# Altium project Low Distortion Oscillator.PrjPcb
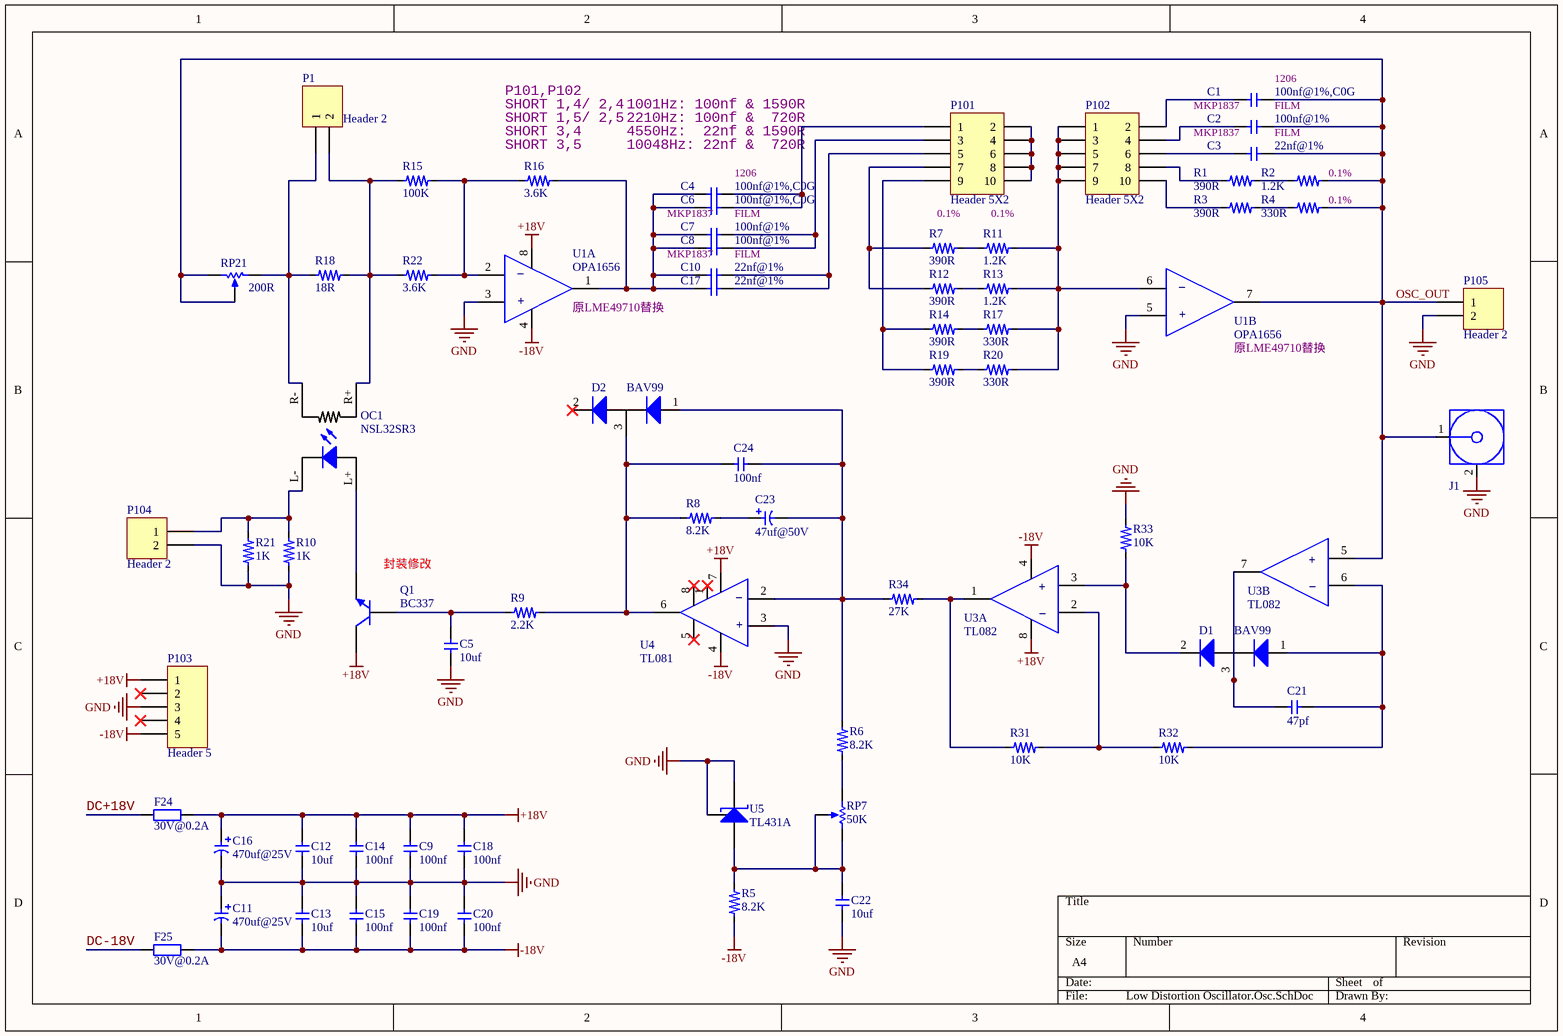
[diagram p0: Low Distortion Oscillator.Osc.SchDoc]
8 sheets, 279 parts. Net scope: global (net labels, ports and power ports of the same name join across sheets).
Board file: Low Distortion Oscillator.PcbDoc
Sheets:
  Low Distortion Oscillator.Osc.SchDoc
  Low Distortion Oscillator.Con.SchDoc
  Low Distortion Oscillator.Notch1.SchDoc
  Low Distortion Oscillator.Amp.SchDoc
  Low Distortion Oscillator.Amp2.SchDoc
  Low Distortion Oscillator.Amp3.SchDoc
  Low Distortion Oscillator.DCDC.SchDoc
  Low Distortion Oscillator.LDO.SchDoc

## Sheet Low Distortion Oscillator.Osc.SchDoc
size A4

### Parts
(Parts that share a designator on the sheet are numbered #1, #2 ... from top to bottom, then left to right.)
C1  value 100nf@1%,C0G  [C1206]  (hidden comment: Cap)
C2  value 100nf@1%  [CAP-FILM-7.2X8.5X10-P5X0.5]  (hidden comment: Cap-Film)
C3  value 22nf@1%  [CAP-FILM-7.2X5.5X7.0-P5X0.5]  (hidden comment: Cap-Film)
C4  value 100nf@1%,C0G  [C1206]  (hidden comment: Cap)
C5  value 10uf  [C0805]  (hidden comment: Cap)
C6  value 100nf@1%,C0G  [C1206]  (hidden comment: Cap)
C7  value 100nf@1%  [CAP-FILM-7.2X8.5X10-P5X0.5]  (hidden comment: Cap-Film)
C8  value 100nf@1%  [CAP-FILM-7.2X8.5X10-P5X0.5]  (hidden comment: Cap-Film)
C9  value 100nf  [C0805]  (hidden comment: Cap)
C10  value 22nf@1%  [CAP-FILM-7.2X5.5X7.0-P5X0.5]  (hidden comment: Cap-Film)
C11  value 470uf@25V  [C8X12]  (hidden comment: Cap2)
C12  value 10uf  [C1206]  (hidden comment: Cap)
C13  value 10uf  [C1206]  (hidden comment: Cap)
C14  value 100nf  [C0805]  (hidden comment: Cap)
C15  value 100nf  [C0805]  (hidden comment: Cap)
C16  value 470uf@25V  [C8X12]  (hidden comment: Cap2)
C17  value 22nf@1%  [CAP-FILM-7.2X5.5X7.0-P5X0.5]  (hidden comment: Cap-Film)
C18  value 100nf  [C0805]  (hidden comment: Cap)
C19  value 100nf  [C0805]  (hidden comment: Cap)
C20  value 100nf  [C0805]  (hidden comment: Cap)
C21  value 47pf  [C0805]  (hidden comment: Cap)
C22  value 10uf  [C0805]  (hidden comment: Cap)
C23  value 47uf@50V  [C6.3X11]  (hidden comment: Cap2)
C24  value 100nf  [C0805]  (hidden comment: Cap)
D1  BAV99  [BAV99-SOT23]
D2  BAV99  [BAV99-SOT23]
F24  value 30V@0.2A  [F1210]  (hidden comment: Fuse)
F25  value 30V@0.2A  [F1210]  (hidden comment: Fuse)
J1  SMA  [SMA-2]  (value not drawn)
OC1  NSL32SR3  [NSL32SR3]
P1  Header 2  [HDR1X2]
P101#1  Header 5X2  [HDR2X5]
P102  Header 5X2  [HDR2X5]
P103  Header 5  [HDR1X5]
P104  Header 2  [HDR1X2]
P105  Header 2  [HDR1X2]
Q1  BC337  [NPN-TO92-CBE]
R1  value 390R  [R0805]  (hidden comment: Res)
R2  value 1.2K  [R0805]  (hidden comment: Res)
R3  value 390R  [R0805]  (hidden comment: Res)
R4  value 330R  [R0805]  (hidden comment: Res)
R5  value 8.2K  [R0805]  (hidden comment: Res)
R6  value 8.2K  [R0805]  (hidden comment: Res)
R7  value 390R  [R0805]  (hidden comment: Res)
R8  value 8.2K  [R0805]  (hidden comment: Res)
R9  value 2.2K  [R0805]  (hidden comment: Res)
R10  value 1K  [R1206]  (hidden comment: Res)
R11  value 1.2K  [R0805]  (hidden comment: Res)
R12  value 390R  [R0805]  (hidden comment: Res)
R13  value 1.2K  [R0805]  (hidden comment: Res)
R14  value 390R  [R0805]  (hidden comment: Res)
R15  value 100K  [R0805]  (hidden comment: Res)
R16  value 3.6K  [R0805]  (hidden comment: Res)
R17  value 330R  [R0805]  (hidden comment: Res)
R18  value 18R  [R0805]  (hidden comment: Res)
R19  value 390R  [R0805]  (hidden comment: Res)
R20  value 330R  [R0805]  (hidden comment: Res)
R21  value 1K  [R1206]  (hidden comment: Res)
R22  value 3.6K  [R0805]  (hidden comment: Res)
R31  value 10K  [R0805]  (hidden comment: Res)
R32  value 10K  [R0805]  (hidden comment: Res)
R33  value 10K  [R0805]  (hidden comment: Res)
R34  value 27K  [R0805]  (hidden comment: Res)
RP7  value 50K  [RP-3296W]  (hidden comment: Res Pot)
RP21  value 200R  [RP-3296W]  (hidden comment: Res Pot)
U1  OPA1656  [OPA1612-SOIC8]  (parts A,B of 2)
U3  TL082  [OPAMP-SOIC8]  (parts A,B of 2)
U4  TL081  [OPAMP-SOIC8]
U5  TL431A  [TL431-SOIC-8]

### Nets
+18V: C9.2 C12.2 C14.2 C16.1 C18.2 F24.2 P103.1 Q1.C U1.8(+Vs) U3.8(+Vs) U4.7(+Vs)
-18V: C11.2 C13.1 C15.1 C19.1 C20.1 F25.2 P103.5 R5.1 U1.4(-Vs) U3.4(-Vs) U4.4(-Vs)
GND: C5.1 C9.1 C11.1 C12.1 C13.2 C14.1 C15.2 C16.2 C18.1 C19.2 C20.2 C22.1 J1.2(GND) P103.3 P104.2 P105.2 R10.1 R21.1 R33.2 U1.3(+IN_A) U1.5(+IN_B) U4.3(+IN) U5.1(Cathode) U5.8(Ref)
DC+18V: F24.1
DC-18V: F25.1
OSC_OUT: C1.2 C2.2 C3.2 J1.1(Signal) P105.1 R2.2 R4.2 RP21.2(TAP) RP21.3(BOT) U1.7(OUT_B) U3.5(+IN_B)
NetC1_1: C1.1 P102.2
NetC2_1: C2.1 P102.4
NetC3_1: C3.1 P102.6
NetC4_1: C4.1 C6.1 C7.1 C8.1 C10.1 C17.1 R16.2 U1.1(OUT_A)
NetC4_2: C4.2 C6.2 P101#1.1
NetC5_2: C5.2 Q1.B R9.1
NetC7_2: C7.2 C8.2 P101#1.3
NetC10_2: C10.2 C17.2 P101#1.5
NetC21_1: C21.1 D1.3(K1/A2) U3.7(OUT_B)
NetC21_2: C21.2 D1.1(A1) R32.2 U3.6(-IN_B)
NetC22_2: C22.2 R5.2 RP7.2(TAP) RP7.3(BOT) U5.2(Anode)
NetC23_1: C23.1 R8.2
NetC23_2: C23.2 C24.2 D2.1(A1) R6.2 R34.1 U4.2(-IN)
NetC24_1: C24.1 D2.3(K1/A2) R8.1 R9.2 U4.6(OUTPUT)
NetD1_2: D1.2(K2) R33.1 U3.3(+IN_A)
NetOC1_L+: OC1.L+ Q1.E
NetOC1_L-: OC1.L- P104.1 R10.2 R21.2
NetOC1_R+: OC1.R+ P1.2 R15.1 R18.2 R22.1
NetOC1_R-: OC1.R- P1.1 R18.1 RP21.1(TOP)
NetP101#1_2: P101#1.2 P101#1.4 P101#1.6 P101#1.8 P101#1.10
NetP101#1_7: P101#1.7 R7.1 R12.1
NetP101#1_9: P101#1.9 R14.1 R19.1
NetP102_1: P102.1 P102.3 P102.5 P102.7 P102.9 R11.2 R13.2 R17.2 R20.2 U1.6(-IN_B)
NetP102_8: P102.8 R1.1
NetP102_10: P102.10 R3.1
NetR1_2: R1.2 R2.1
NetR3_2: R3.2 R4.1
NetR6_1: R6.1 RP7.1(TOP)
NetR7_2: R7.2 R11.1
NetR12_2: R12.2 R13.1
NetR14_2: R14.2 R17.1
NetR15_2: R15.2 R16.1 R22.2 U1.2(-IN_A)
NetR19_2: R19.2 R20.1
NetR31_1: R31.1 R34.2 U3.1(OUT_A)
NetR31_2: R31.2 R32.1 U3.2(-IN_A)

Not connected (* = marked no-connect by the designer): D2 2(K2)*; P103 2* 4*; U4 1(OFFSET_NULL)* 5(NC)* 8(OFFSET_NULL)*

### Notes on the sheet
- SHORT 1,4/ 2,4
- P101,P102
- 1001Hz: 100nf & 1590R
- MKP1837
- (near C1) 1206
- FILM
- SHORT 1,5/ 2,5
- (near R16) SHORT 3,4
- (near R16) SHORT 3,5
- 2210Hz: 100nf &  720R
- 4550Hz:  22nf & 1590R
- 10048Hz: 22nf &  720R
- 1206
- (near R2) 0.1%
- (near C6) MKP1837
- 0.1%
- (near R4) 0.1%
- (near U1) 原LME49710替换
- (near C8) MKP1837
- (near Q1) 封装修改
- (in symbol OP AMP 1#) –; +
- (in symbol OP AMP 2#, part A) +; –
- (in symbol OP AMP 2#, part B) +; –
- (in symbol OPA1612, part A) –; +
- (in symbol OPA1612, part B) –; +

### Library data of the parts
D1 D2 = BAV99: Small Signal Switching Diode, Dual in Series
OC1 = NSL32SR3: This optocoupler, NSL-32SR3, consists of an LED input optically coupled to a photocell. The photocell resistance is high when the LED current is “off” and low resistance when the LED current is “on”.
P1 P104 P105 = Header 2: Header, 2-Pin
P101#1 P102 = Header 5X2: Header, 5-Pin, Dual row
P103 = Header 5: Header, 5-Pin
Q1 = NPN: NPN General Purpose Amplifier
R1-R22 R31-R34 = Res: 电阻
RP7 RP21 = Res Pot: 电位器
U1 = OPA1612: OPA161x SoundPlus™ High-Performance, Bipolar-Input Audio Operational Amplifiers
U3 = OP AMP 2#: Universal Operational Amplifiers.
U4 = OP AMP 1#: Universal Operational Amplifiers.
U5 = TL431: 精密可编程基准

## Sheet Low Distortion Oscillator.Con.SchDoc
size A4; SheetNumber: 1; SheetTotal: 1
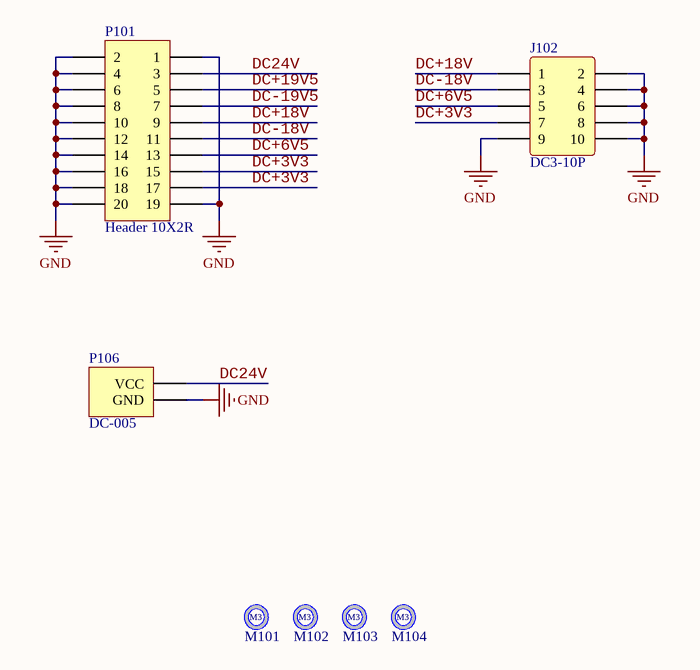
[diagram p1: Low Distortion Oscillator.Con.SchDoc]

### Parts
(Parts that share a designator on the sheet are numbered #1, #2 ... from top to bottom, then left to right.)
J102  DC3-10P  [DC3-10P]
M101  M3  [M3-3.2X5]  (value not drawn)
M102  M3  [M3-3.2X5]  (value not drawn)
M103  M3  [M3-3.2X5]  (value not drawn)
M104  M3  [M3-3.2X5]  (value not drawn)
P101#2  Header 10X2R  [HDR2X10LFR]
P106  DC-005  [DC-005]

### Nets
GND: J102.2 J102.4 J102.6 J102.8 J102.9 J102.10 P101#2.1 P101#2.2 P101#2.4 P101#2.6 P101#2.8 P101#2.10 P101#2.12 P101#2.14 P101#2.16 P101#2.18 P101#2.19 P101#2.20 P106.2(GND)
DC24V: P101#2.3 P106.1(VCC)
DC+3V3: J102.7 P101#2.15 P101#2.17
DC+6V5: J102.5 P101#2.13
DC+18V: J102.1 P101#2.9
DC+19V5: P101#2.5
DC-18V: J102.3 P101#2.11
DC-19V5: P101#2.7

### Library data of the parts
P101#2 = Header 10X2R: Header, 10-Pin, Dual row, Pin 1 on Right

## Sheet Low Distortion Oscillator.Notch1.SchDoc
size A4
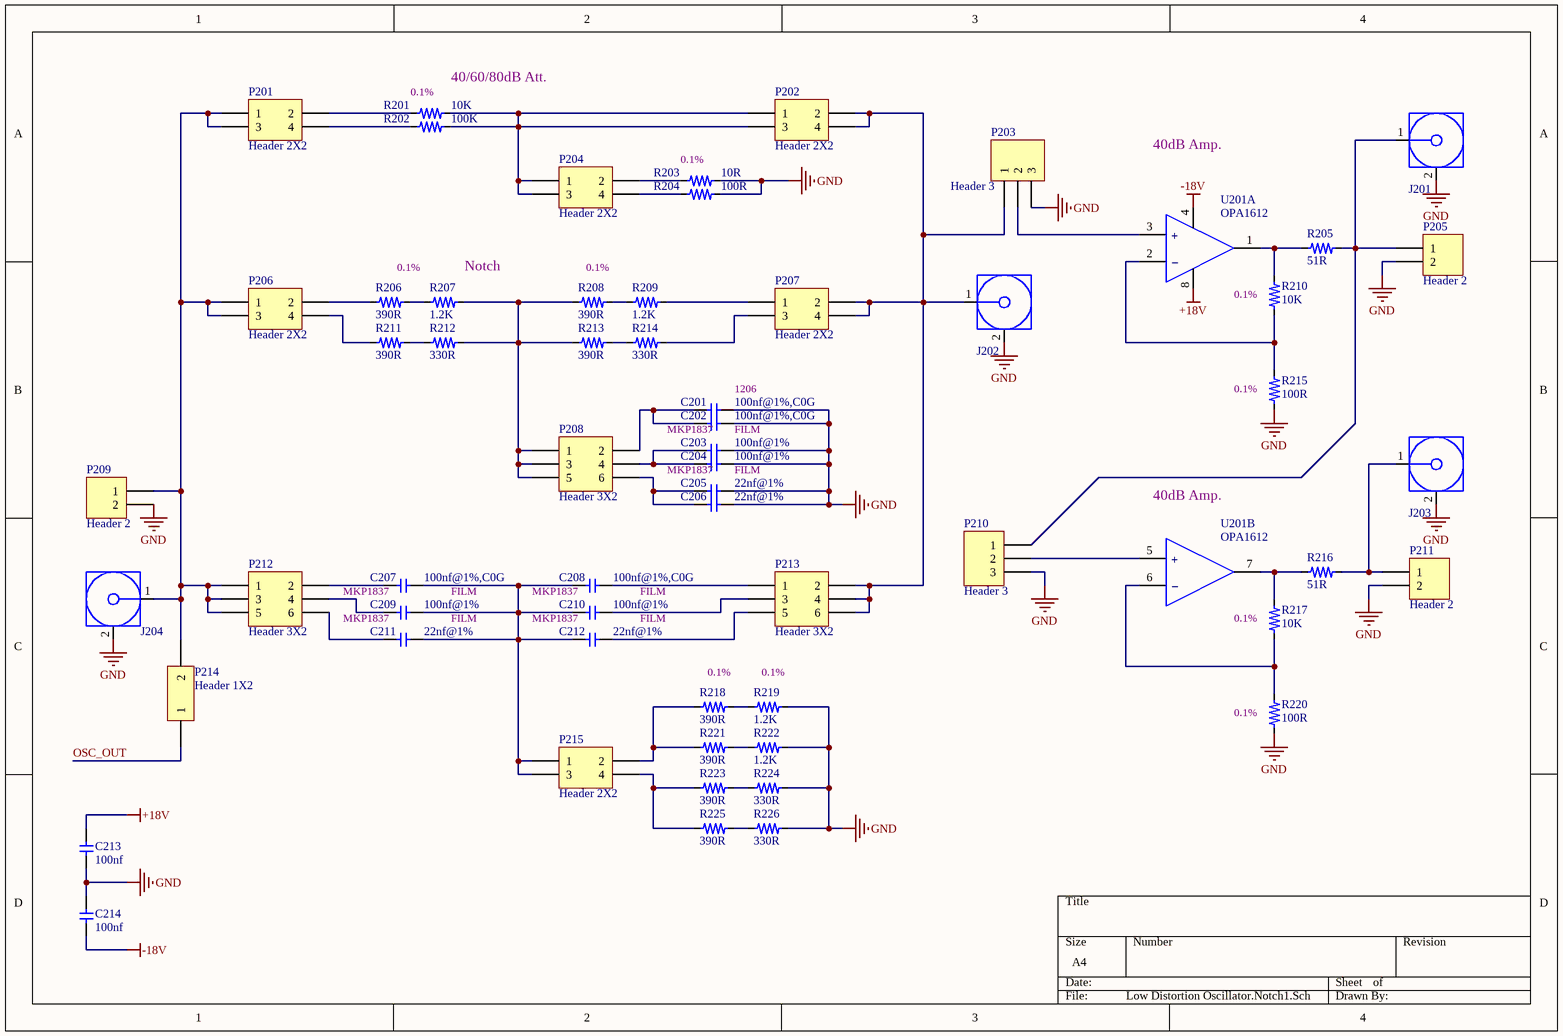
[diagram p2: Low Distortion Oscillator.Notch1.SchDoc]

### Parts
C201  value 100nf@1%,C0G  [C1206]  (hidden comment: Cap)
C202  value 100nf@1%,C0G  [C1206]  (hidden comment: Cap)
C203  value 100nf@1%  [CAP-FILM-7.2X8.5X10-P5X0.5]  (hidden comment: Cap-Film)
C204  value 100nf@1%  [CAP-FILM-7.2X8.5X10-P5X0.5]  (hidden comment: Cap-Film)
C205  value 22nf@1%  [CAP-FILM-7.2X5.5X7.0-P5X0.5]  (hidden comment: Cap-Film)
C206  value 22nf@1%  [CAP-FILM-7.2X5.5X7.0-P5X0.5]  (hidden comment: Cap-Film)
C207  value 100nf@1%,C0G  [C1206]  (hidden comment: Cap)
C208  value 100nf@1%,C0G  [C1206]  (hidden comment: Cap)
C209  value 100nf@1%  [CAP-FILM-7.2X8.5X10-P5X0.5]  (hidden comment: Cap-Film)
C210  value 100nf@1%  [CAP-FILM-7.2X8.5X10-P5X0.5]  (hidden comment: Cap-Film)
C211  value 22nf@1%  [CAP-FILM-7.2X5.5X7.0-P5X0.5]  (hidden comment: Cap-Film)
C212  value 22nf@1%  [CAP-FILM-7.2X5.5X7.0-P5X0.5]  (hidden comment: Cap-Film)
C213  value 100nf  [C0805]  (hidden comment: Cap)
C214  value 100nf  [C0805]  (hidden comment: Cap)
J201  SMA  [SMA-2]  (value not drawn)
J202  SMA  [SMA-2]  (value not drawn)
J203  SMA  [SMA-2]  (value not drawn)
J204  SMA  [SMA-2]  (value not drawn)
P201  Header 2X2  [HDR2X2]
P202  Header 2X2  [HDR2X2]
P203  Header 3  [HDR1X3]
P204  Header 2X2  [HDR2X2]
P205  Header 2  [HDR1X2]
P206  Header 2X2  [HDR2X2]
P207  Header 2X2  [HDR2X2]
P208  Header 3X2  [HDR2X3]
P209  Header 2  [HDR1X2]
P210  Header 3  [HDR1X3]
P211  Header 2  [HDR1X2]
P212  Header 3X2  [HDR2X3]
P213  Header 3X2  [HDR2X3]
P214  Header 1X2  [HDR2X1]
P215  Header 2X2  [HDR2X2]
R201  value 10K  [R0805]  (hidden comment: Res)
R202  value 100K  [R0805]  (hidden comment: Res)
R203  value 10R  [R0805]  (hidden comment: Res)
R204  value 100R  [R0805]  (hidden comment: Res)
R205  value 51R  [R0805]  (hidden comment: Res)
R206  value 390R  [R0805]  (hidden comment: Res)
R207  value 1.2K  [R0805]  (hidden comment: Res)
R208  value 390R  [R0805]  (hidden comment: Res)
R209  value 1.2K  [R0805]  (hidden comment: Res)
R210  value 10K  [R0805]  (hidden comment: Res)
R211  value 390R  [R0805]  (hidden comment: Res)
R212  value 330R  [R0805]  (hidden comment: Res)
R213  value 390R  [R0805]  (hidden comment: Res)
R214  value 330R  [R0805]  (hidden comment: Res)
R215  value 100R  [R0805]  (hidden comment: Res)
R216  value 51R  [R0805]  (hidden comment: Res)
R217  value 10K  [R0805]  (hidden comment: Res)
R218  value 390R  [R0805]  (hidden comment: Res)
R219  value 1.2K  [R0805]  (hidden comment: Res)
R220  value 100R  [R0805]  (hidden comment: Res)
R221  value 390R  [R0805]  (hidden comment: Res)
R222  value 1.2K  [R0805]  (hidden comment: Res)
R223  value 390R  [R0805]  (hidden comment: Res)
R224  value 330R  [R0805]  (hidden comment: Res)
R225  value 390R  [R0805]  (hidden comment: Res)
R226  value 330R  [R0805]  (hidden comment: Res)
U201  OPA1612  [OPA1612-SOIC8]  (parts A,B of 2)

### Nets
+18V: C213.2 U201.8(+Vs)
-18V: C214.1 U201.4(-Vs)
GND: C201.2 C202.2 C203.2 C204.2 C205.2 C206.2 C213.1 C214.2 J201.2(GND) J202.2(GND) J203.2(GND) J204.2(GND) P203.3 P205.2 P209.2 P210.3 P211.2 R203.1 R204.1 R215.1 R219.2 R220.1 R222.2 R224.2 R226.2
OSC_OUT: P214.1
NetC201_1: C201.1 C202.1 P208.2
NetC203_1: C203.1 C204.1 P208.4
NetC205_1: C205.1 C206.1 P208.6
NetC207_1: C207.1 P212.2
NetC207_2: C207.2 C208.1 C209.2 C210.1 C211.2 C212.1 P215.1 P215.3
NetC208_2: C208.2 P213.1
NetC209_1: C209.1 P212.4
NetC210_2: C210.2 P213.3
NetC211_1: C211.1 P212.6
NetC212_2: C212.2 P213.5
NetJ201_1: J201.1(Signal) P205.1 P210.1 R205.2
NetJ202_1: J202.1(Signal) P202.2 P202.4 P203.1 P207.2 P207.4 P213.2 P213.4 P213.6
NetJ203_1: J203.1(Signal) P211.1 R216.2
NetJ204_1: J204.1(Signal) P201.1 P201.3 P206.1 P206.3 P209.1 P212.1 P212.3 P212.5 P214.2
NetP201_2: P201.2 R201.1
NetP201_4: P201.4 R202.1
NetP202_1: P202.1 P202.3 P204.1 P204.3 R201.2 R202.2
NetP203_2: P203.2 U201.3(+IN_A)
NetP204_2: P204.2 R203.2
NetP204_4: P204.4 R204.2
NetP206_2: P206.2 R206.1
NetP206_4: P206.4 R211.1
NetP207_1: P207.1 R209.2
NetP207_3: P207.3 R214.2
NetP208_1: P208.1 P208.3 P208.5 R207.2 R208.1 R212.2 R213.1
NetP210_2: P210.2 U201.5(+IN_B)
NetP215_2: P215.2 R218.1 R221.1
NetP215_4: P215.4 R223.1 R225.1
NetR205_1: R205.1 R210.2 U201.1(OUT_A)
NetR206_2: R206.2 R207.1
NetR208_2: R208.2 R209.1
NetR210_1: R210.1 R215.2 U201.2(-IN_A)
NetR211_2: R211.2 R212.1
NetR213_2: R213.2 R214.1
NetR216_1: R216.1 R217.2 U201.7(OUT_B)
NetR217_1: R217.1 R220.2 U201.6(-IN_B)
NetR218_2: R218.2 R219.1
NetR221_2: R221.2 R222.1
NetR223_2: R223.2 R224.1
NetR225_2: R225.2 R226.1

### Notes on the sheet
- (near R201) 0.1%
- 40/60/80dB Att.
- (near R203) 0.1%
- 40dB Amp.
- 0.1%
- (near R207) Notch
- (near C202) MKP1837
- 1206
- FILM
- (near R215) 0.1%
- (near C204) MKP1837
- MKP1837
- (near R220) 0.1%
- (in symbol OPA1612, part A) +; –
- (in symbol OPA1612, part B) +; –

### Library data of the parts
P201 P202 P204 P206 P207 P215 = Header 2X2: Header, 2-Pin, Dual row
P203 P210 = Header 3: Header, 3-Pin
P205 P209 P211 = Header 2: Header, 2-Pin
P208 P212 P213 = Header 3X2: Header, 3-Pin, Dual row
P214 = Header 1X2: Header, 1-Pin, Dual row
R201-R226 = Res: 电阻
U201 = OPA1612: as U1 on sheet Low Distortion Oscillator.Osc

## Sheet Low Distortion Oscillator.Amp.SchDoc
size A4
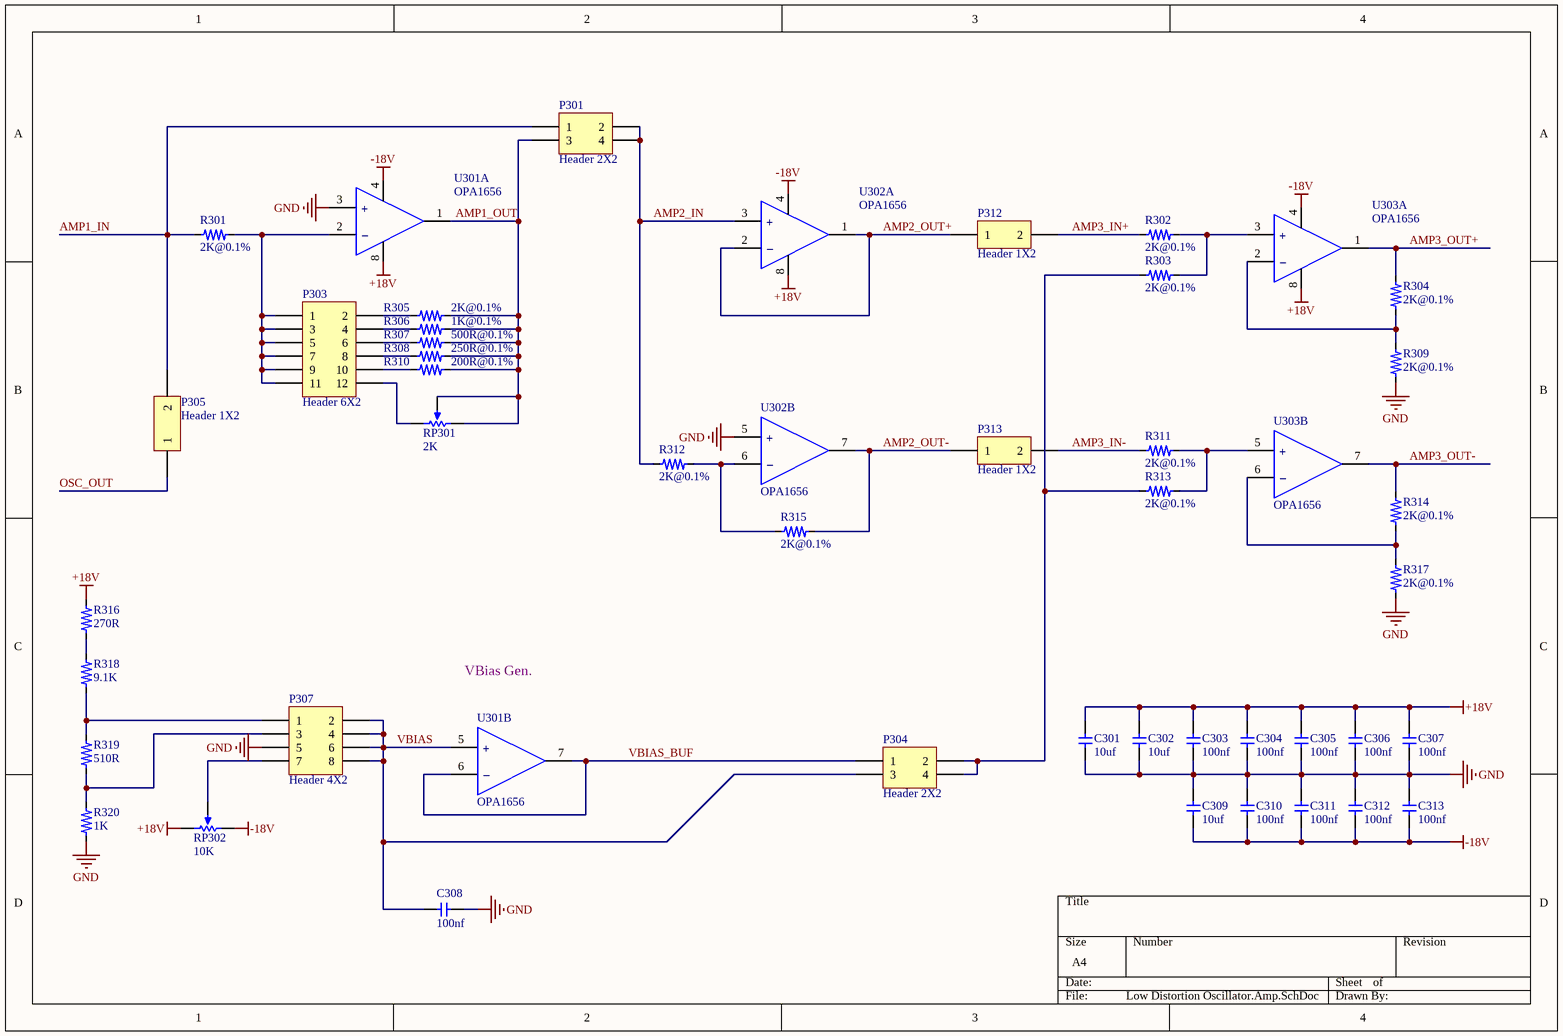
[diagram p3: Low Distortion Oscillator.Amp.SchDoc]

### Parts
C301  value 10uf  [C1206]  (hidden comment: Cap)
C302  value 10uf  [C1206]  (hidden comment: Cap)
C303  value 100nf  [C0805]  (hidden comment: Cap)
C304  value 100nf  [C0805]  (hidden comment: Cap)
C305  value 100nf  [C0805]  (hidden comment: Cap)
C306  value 100nf  [C0805]  (hidden comment: Cap)
C307  value 100nf  [C0805]  (hidden comment: Cap)
C308  value 100nf  [C0805]  (hidden comment: Cap)
C309  value 10uf  [C1206]  (hidden comment: Cap)
C310  value 100nf  [C0805]  (hidden comment: Cap)
C311  value 100nf  [C0805]  (hidden comment: Cap)
C312  value 100nf  [C0805]  (hidden comment: Cap)
C313  value 100nf  [C0805]  (hidden comment: Cap)
P301  Header 2X2  [HDR2X2]
P303  Header 6X2  [HDR2X6]
P304  Header 2X2  [HDR2X2]
P305  Header 1X2  [HDR2X1]
P307  Header 4X2  [HDR2X4]
P312  Header 1X2  [HDR2X1]
P313  Header 1X2  [HDR2X1]
R301  value 2K@0.1%  [R0805]  (hidden comment: Res)
R302  value 2K@0.1%  [R0805]  (hidden comment: Res)
R303  value 2K@0.1%  [R0805]  (hidden comment: Res)
R304  value 2K@0.1%  [R0805]  (hidden comment: Res)
R305  value 2K@0.1%  [R0805]  (hidden comment: Res)
R306  value 1K@0.1%  [R0805]  (hidden comment: Res)
R307  value 500R@0.1%  [R0805]  (hidden comment: Res)
R308  value 250R@0.1%  [R0805]  (hidden comment: Res)
R309  value 2K@0.1%  [R0805]  (hidden comment: Res)
R310  value 200R@0.1%  [R0805]  (hidden comment: Res)
R311  value 2K@0.1%  [R0805]  (hidden comment: Res)
R312  value 2K@0.1%  [R0805]  (hidden comment: Res)
R313  value 2K@0.1%  [R0805]  (hidden comment: Res)
R314  value 2K@0.1%  [R0805]  (hidden comment: Res)
R315  value 2K@0.1%  [R0805]  (hidden comment: Res)
R316  value 270R  [R0805]  (hidden comment: Res)
R317  value 2K@0.1%  [R0805]  (hidden comment: Res)
R318  value 9.1K  [R0805]  (hidden comment: Res)
R319  value 510R  [R0805]  (hidden comment: Res)
R320  value 1K  [R0805]  (hidden comment: Res)
RP301  value 2K  [RP-3590S-2]  (hidden comment: Res Pot)
RP302  value 10K  [RP-3590S-2]  (hidden comment: Res Pot)
U301  OPA1656  [OPAMP-SOIC8]  (parts A,B of 2)
U302  OPA1656  [OPAMP-SOIC8]  (parts A,B of 2)
U303  OPA1656  [OPAMP-SOIC8]  (parts A,B of 2)

### Nets
+18V: C301.2 C302.2 C303.2 C304.2 C305.2 C306.2 C307.2 R316.2 RP302.3(BOT) U301.8(+Vs) U302.8(+Vs) U303.8(+Vs)
-18V: C309.1 C310.1 C311.1 C312.1 C313.1 RP302.1(TOP) U301.4(-Vs) U302.4(-Vs) U303.4(-Vs)
GND: C301.1 C302.1 C303.1 C304.1 C305.1 C306.1 C307.1 C308.1 C309.2 C310.2 C311.2 C312.2 C313.2 P307.5 R309.2 R317.2 R320.1 U301.3(+IN_A) U302.5(+IN_B)
AMP1_IN: P301.1 P305.2 R301.2
AMP1_OUT: P301.3 R305.1 R306.1 R307.1 R308.1 R310.1 RP301.1(TOP) RP301.2(TAP) U301.1(OUT_A)
AMP2_IN: P301.2 P301.4 R312.2 U302.3(+IN_A)
AMP2_OUT+: P312.1 U302.1(OUT_A) U302.2(-IN_A)
AMP2_OUT-: P313.1 R315.1 U302.7(OUT_B)
AMP3_IN+: P312.2 R302.2
AMP3_IN-: P313.2 R311.2
AMP3_OUT+: R304.1 U303.1(OUT_A)
AMP3_OUT-: R314.1 U303.7(OUT_B)
OSC_OUT: P305.1
VBIAS: C308.2 P304.3 P307.2 P307.4 P307.6 P307.8 U301.5(+IN_B)
VBIAS_BUF: P304.1 U301.6(-IN_B) U301.7(OUT_B)
NetP303_1: P303.1 P303.3 P303.5 P303.7 P303.9 P303.11 R301.1 U301.2(-IN_A)
NetP303_2: P303.2 R305.2
NetP303_4: P303.4 R306.2
NetP303_6: P303.6 R307.2
NetP303_8: P303.8 R308.2
NetP303_10: P303.10 R310.2
NetP303_12: P303.12 RP301.3(BOT)
NetP304_2: P304.2 P304.4 R303.2 R313.2
NetP307_1: P307.1 R318.1 R319.2
NetP307_3: P307.3 R319.1 R320.2
NetP307_7: P307.7 RP302.2(TAP)
NetR302_1: R302.1 R303.1 U303.3(+IN_A)
NetR304_2: R304.2 R309.1 U303.2(-IN_A)
NetR311_1: R311.1 R313.1 U303.5(+IN_B)
NetR312_1: R312.1 R315.2 U302.6(-IN_B)
NetR314_2: R314.2 R317.1 U303.6(-IN_B)
NetR316_1: R316.1 R318.2

### Notes on the sheet
- VBias Gen.
- (in symbol OP AMP 2#, part A) +; –
- (in symbol OP AMP 2#, part B) +; –

### Library data of the parts
P301 P304 = Header 2X2: Header, 2-Pin, Dual row
P303 = Header 6X2: Header, 6-Pin, Dual row
P305 P312 P313 = Header 1X2: Header, 1-Pin, Dual row
P307 = Header 4X2: Header, 4-Pin, Dual row
R301-R320 = Res: 电阻
RP301 RP302 = Res Pot: 电位器
U301-U303 = OP AMP 2#: Universal Operational Amplifiers.

## Sheet Low Distortion Oscillator.Amp2.SchDoc
size A4
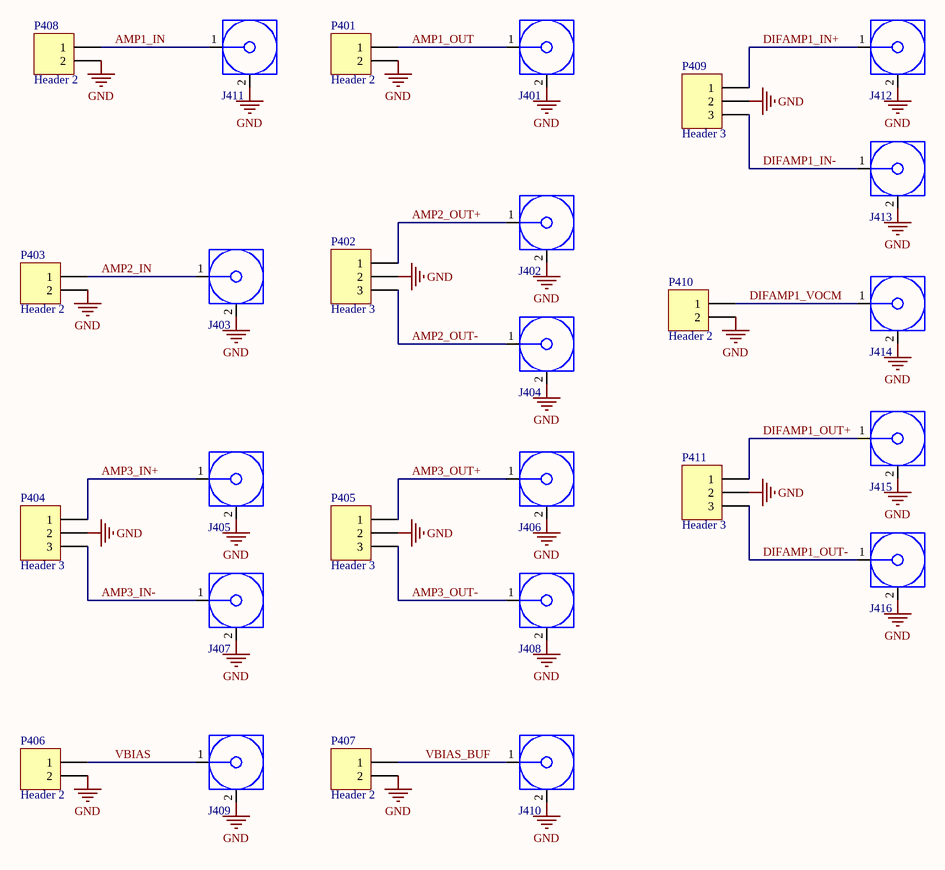
[diagram p4: Low Distortion Oscillator.Amp2.SchDoc]

### Parts
J401  SMA  [SMA-2]  (value not drawn)
J402  SMA  [SMA-2]  (value not drawn)
J403  SMA  [SMA-2]  (value not drawn)
J404  SMA  [SMA-2]  (value not drawn)
J405  SMA  [SMA-2]  (value not drawn)
J406  SMA  [SMA-2]  (value not drawn)
J407  SMA  [SMA-2]  (value not drawn)
J408  SMA  [SMA-2]  (value not drawn)
J409  SMA  [SMA-2]  (value not drawn)
J410  SMA  [SMA-2]  (value not drawn)
J411  SMA  [SMA-2]  (value not drawn)
J412  SMA  [SMA-2]  (value not drawn)
J413  SMA  [SMA-2]  (value not drawn)
J414  SMA  [SMA-2]  (value not drawn)
J415  SMA  [SMA-2]  (value not drawn)
J416  SMA  [SMA-2]  (value not drawn)
P401  Header 2  [HDR1X2]
P402  Header 3  [HDR1X3]
P403  Header 2  [HDR1X2]
P404  Header 3  [HDR1X3]
P405  Header 3  [HDR1X3]
P406  Header 2  [HDR1X2]
P407  Header 2  [HDR1X2]
P408  Header 2  [HDR1X2]
P409  Header 3  [HDR1X3]
P410  Header 2  [HDR1X2]
P411  Header 3  [HDR1X3]

### Nets
GND: J401.2(GND) J402.2(GND) J403.2(GND) J404.2(GND) J405.2(GND) J406.2(GND) J407.2(GND) J408.2(GND) J409.2(GND) J410.2(GND) J411.2(GND) J412.2(GND) J413.2(GND) J414.2(GND) J415.2(GND) J416.2(GND) P401.2 P402.2 P403.2 P404.2 P405.2 P406.2 P407.2 P408.2 P409.2 P410.2 P411.2
AMP1_IN: J411.1(Signal) P408.1
AMP1_OUT: J401.1(Signal) P401.1
AMP2_IN: J403.1(Signal) P403.1
AMP2_OUT+: J402.1(Signal) P402.1
AMP2_OUT-: J404.1(Signal) P402.3
AMP3_IN+: J405.1(Signal) P404.1
AMP3_IN-: J407.1(Signal) P404.3
AMP3_OUT+: J406.1(Signal) P405.1
AMP3_OUT-: J408.1(Signal) P405.3
DIFAMP1_IN+: J412.1(Signal) P409.1
DIFAMP1_IN-: J413.1(Signal) P409.3
DIFAMP1_OUT+: J415.1(Signal) P411.1
DIFAMP1_OUT-: J416.1(Signal) P411.3
DIFAMP1_VOCM: J414.1(Signal) P410.1
VBIAS: J409.1(Signal) P406.1
VBIAS_BUF: J410.1(Signal) P407.1

### Library data of the parts
P401 P403 P406-P408 P410 = Header 2: Header, 2-Pin
P402 P404 P405 P409 P411 = Header 3: Header, 3-Pin

## Sheet Low Distortion Oscillator.Amp3.SchDoc
size A4
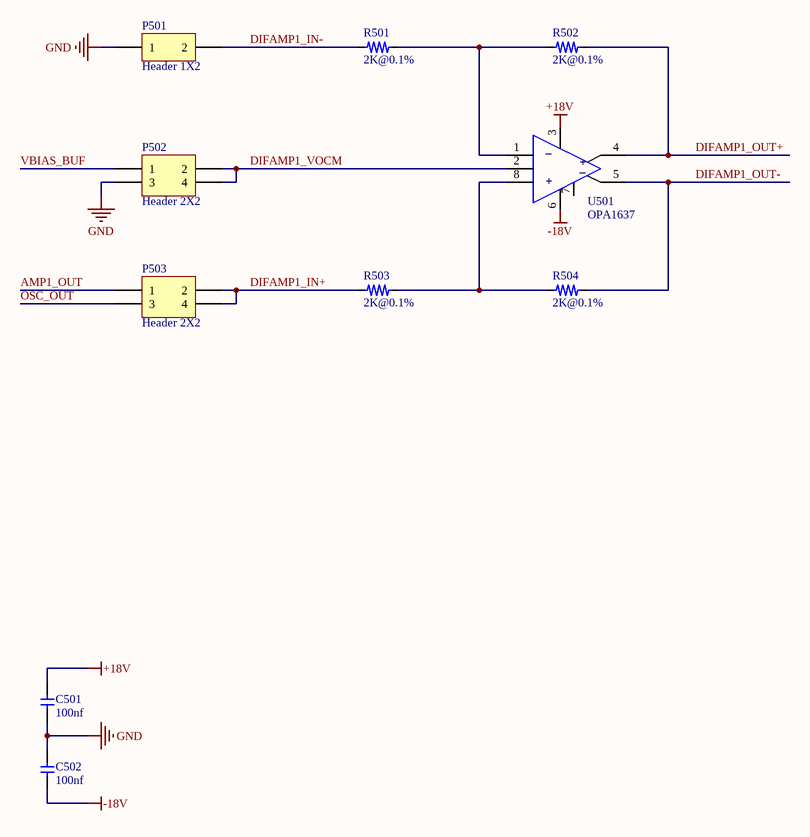
[diagram p5: Low Distortion Oscillator.Amp3.SchDoc]

### Parts
C501  value 100nf  [C0805]  (hidden comment: Cap)
C502  value 100nf  [C0805]  (hidden comment: Cap)
P501  Header 1X2  [HDR2X1]
P502  Header 2X2  [HDR2X2]
P503  Header 2X2  [HDR2X2]
R501  value 2K@0.1%  [R0805]  (hidden comment: Res)
R502  value 2K@0.1%  [R0805]  (hidden comment: Res)
R503  value 2K@0.1%  [R0805]  (hidden comment: Res)
R504  value 2K@0.1%  [R0805]  (hidden comment: Res)
U501  OPA1637  [OPA1637-VSSOP8]

### Nets
+18V: C501.2 U501.3(+Vs)
-18V: C502.1 U501.6(-Vs)
GND: C501.1 C502.2 P501.1 P502.3
AMP1_OUT: P503.1
DIFAMP1_IN+: P503.2 P503.4 R503.2
DIFAMP1_IN-: P501.2 R501.2
DIFAMP1_OUT+: R502.1 U501.4(OUT+)
DIFAMP1_OUT-: R504.1 U501.5(OUT-)
DIFAMP1_VOCM: P502.2 P502.4 U501.2(VOCM)
OSC_OUT: P503.3
VBIAS_BUF: P502.1
NetR501_1: R501.1 R502.2 U501.1(-IN)
NetR503_1: R503.1 R504.2 U501.8(+IN)

Not connected (* = marked no-connect by the designer): U501 7(~{PD})

### Notes on the sheet
- (in symbol OPA1637) –; +

### Library data of the parts
P501 = Header 1X2: Header, 1-Pin, Dual row
P502 P503 = Header 2X2: Header, 2-Pin, Dual row
R501-R504 = Res: 电阻
U501 = OPA1637: OPA1637 High-Fidelity, Low-Noise, Fully-Differential, Burr-Brown™ Audio Operational Amplifier

## Sheet Low Distortion Oscillator.DCDC.SchDoc
size A4
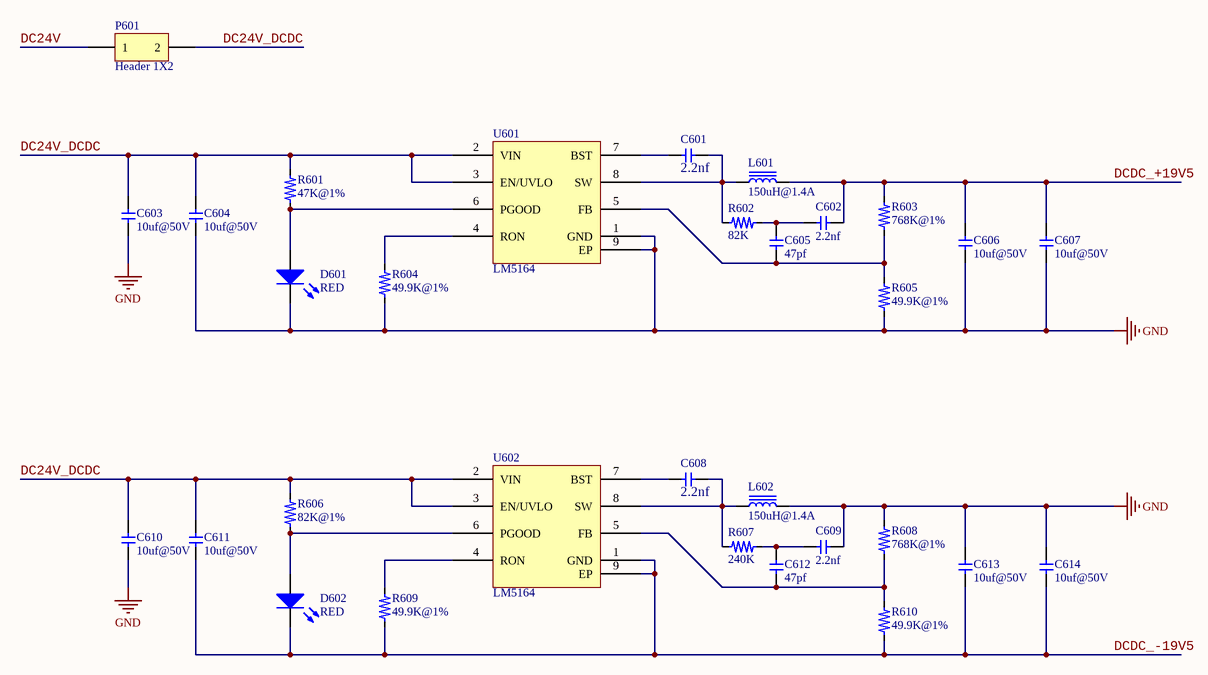
[diagram p6: Low Distortion Oscillator.DCDC.SchDoc]

### Parts
C601  value 2.2nf  [C0603]  (hidden comment: Cap)
C602  value 2.2nf  [C0603]  (hidden comment: Cap)
C603  value 10uf@50V  [C1206]  (hidden comment: Cap)
C604  value 10uf@50V  [C1206]  (hidden comment: Cap)
C605  value 47pf  [C0603]  (hidden comment: Cap)
C606  value 10uf@50V  [C1206]  (hidden comment: Cap)
C607  value 10uf@50V  [C1206]  (hidden comment: Cap)
C608  value 2.2nf  [C0603]  (hidden comment: Cap)
C609  value 2.2nf  [C0603]  (hidden comment: Cap)
C610  value 10uf@50V  [C1206]  (hidden comment: Cap)
C611  value 10uf@50V  [C1206]  (hidden comment: Cap)
C612  value 47pf  [C0603]  (hidden comment: Cap)
C613  value 10uf@50V  [C1206]  (hidden comment: Cap)
C614  value 10uf@50V  [C1206]  (hidden comment: Cap)
D601  value RED  [LED0603]  (hidden comment: LED)
D602  value RED  [LED0603]  (hidden comment: LED)
L601  value 150uH@1.4A  [L12127]  (hidden comment: Inductor Iron)
L602  value 150uH@1.4A  [L12127]  (hidden comment: Inductor Iron)
P601  Header 1X2  [HDR2X1]
R601  value 47K@1%  [R0603]  (hidden comment: Res)
R602  value 82K  [R0603]  (hidden comment: Res)
R603  value 768K@1%  [R0603]  (hidden comment: Res)
R604  value 49.9K@1%  [R0603]  (hidden comment: Res)
R605  value 49.9K@1%  [R0603]  (hidden comment: Res)
R606  value 82K@1%  [R0603]  (hidden comment: Res)
R607  value 240K  [R0603]  (hidden comment: Res)
R608  value 768K@1%  [R0603]  (hidden comment: Res)
R609  value 49.9K@1%  [R0603]  (hidden comment: Res)
R610  value 49.9K@1%  [R0603]  (hidden comment: Res)
U601  LM5164  [LM5164-SOIC8]
U602  LM5164  [LM5164-SOIC8]

### Nets
GND: C603.1 C604.1 C606.1 C607.1 C609.2 C610.1 C613.2 C614.2 D601.2(K) L602.2 R604.1 R605.1 R608.2 U601.1(GND) U601.9(EP)
DC24V: P601.1
DC24V_DCDC: C603.2 C604.2 C610.2 C611.2 P601.2 R601.2 R606.2 U601.2(VIN) U601.3(EN/UVLO) U602.2(VIN) U602.3(EN/UVLO)
DCDC_+19V5: C602.2 C606.2 C607.2 L601.2 R603.2
DCDC_-19V5: C611.1 C613.1 C614.1 D602.2(K) R609.1 R610.1 U602.1(GND) U602.9(EP)
NetC601_1: C601.1 L601.1 R602.2 U601.8(SW)
NetC601_2: C601.2 U601.7(BST)
NetC602_1: C602.1 C605.1 R602.1
NetC605_2: C605.2 R603.1 R605.2 U601.5(FB)
NetC608_1: C608.1 L602.1 R607.2 U602.8(SW)
NetC608_2: C608.2 U602.7(BST)
NetC609_1: C609.1 C612.1 R607.1
NetC612_2: C612.2 R608.1 R610.2 U602.5(FB)
NetD601_1: D601.1(A) R601.1 U601.6(PGOOD)
NetD602_1: D602.1(A) R606.1 U602.6(PGOOD)
NetR604_2: R604.2 U601.4(RON)
NetR609_2: R609.2 U602.4(RON)

### Library data of the parts
L601 L602 = Inductor Iron: Magnetic-Core Inductor
P601 = Header 1X2: Header, 1-Pin, Dual row
R601-R610 = Res: 电阻
U601 U602 = LM5164: LM5164 100-V Input, 1-A synchronous buck DC/DC converter with ultra-low IQ

## Sheet Low Distortion Oscillator.LDO.SchDoc
size A4
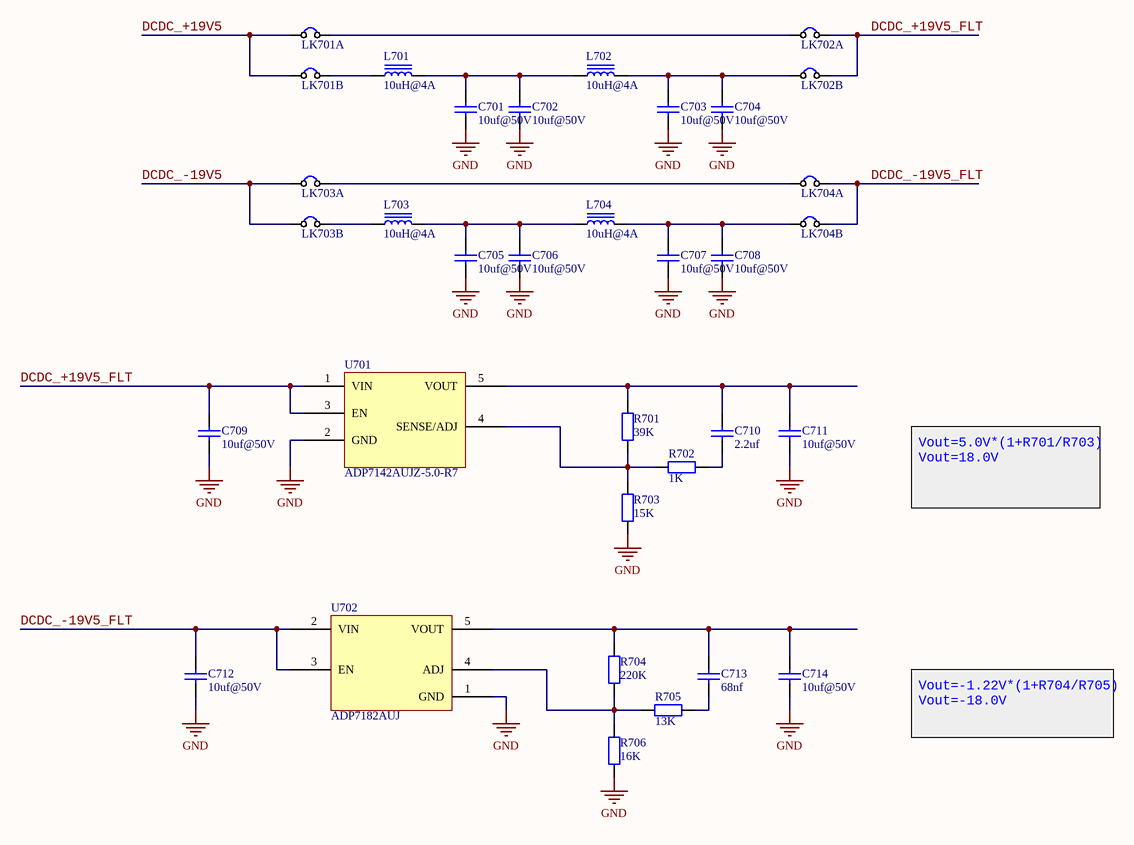
[diagram p7: Low Distortion Oscillator.LDO.SchDoc]

### Parts
C701  value 10uf@50V  [C1206]  (hidden comment: Cap)
C702  value 10uf@50V  [C1206]  (hidden comment: Cap)
C703  value 10uf@50V  [C1206]  (hidden comment: Cap)
C704  value 10uf@50V  [C1206]  (hidden comment: Cap)
C705  value 10uf@50V  [C1206]  (hidden comment: Cap)
C706  value 10uf@50V  [C1206]  (hidden comment: Cap)
C707  value 10uf@50V  [C1206]  (hidden comment: Cap)
C708  value 10uf@50V  [C1206]  (hidden comment: Cap)
C709  value 10uf@50V  [C1206]  (hidden comment: Cap)
C710  value 2.2uf  [C0603]  (hidden comment: Cap)
C711  value 10uf@50V  [C1206]  (hidden comment: Cap)
C712  value 10uf@50V  [C0805]  (hidden comment: Cap)
C713  value 68nf  [C0603]  (hidden comment: Cap)
C714  value 10uf@50V  [C1206]  (hidden comment: Cap)
L701  value 10uH@4A  [L06063]  (hidden comment: Inductor Iron)
L702  value 10uH@4A  [L06063]  (hidden comment: Inductor Iron)
L703  value 10uH@4A  [L06063]  (hidden comment: Inductor Iron)
L704  value 10uH@4A  [L06063]  (hidden comment: Inductor Iron)
LK701  Link-2X2  [Link-2X2-THD]  (value not drawn)  (parts A,B of 2)
LK702  Link-2X2  [Link-2X2-THD]  (value not drawn)  (parts A,B of 2)
LK703  Link-2X2  [Link-2X2-THD]  (value not drawn)  (parts A,B of 2)
LK704  Link-2X2  [Link-2X2-THD]  (value not drawn)  (parts A,B of 2)
R701  value 39K  [R0603]  (hidden comment: Res)
R702  value 1K  [R0603]  (hidden comment: Res)
R703  value 15K  [R0603]  (hidden comment: Res)
R704  value 220K  [R0603]  (hidden comment: Res)
R705  value 13K  [R0603]  (hidden comment: Res)
R706  value 16K  [R0603]  (hidden comment: Res)
U701  ADP7142AUJZ-5.0-R7  [ADP7142-TSOT5]
U702  ADP7182AUJ  [ADP7182-TSOT5]

### Nets
GND: C701.1 C702.1 C703.1 C704.1 C705.1 C706.1 C707.1 C708.1 C709.1 C711.1 C712.1 C714.1 R703.1 R706.1 U701.2(GND) U702.1(GND)
DCDC_+19V5: LK701.1 LK701.3
DCDC_+19V5_FLT: C709.2 LK702.2 LK702.4 U701.1(VIN) U701.3(EN)
DCDC_-19V5: LK703.1 LK703.3
DCDC_-19V5_FLT: C712.2 LK704.2 LK704.4 U702.2(VIN) U702.3(EN)
NetC701_2: C701.2 C702.2 L701.2 L702.1
NetC703_2: C703.2 C704.2 L702.2 LK702.3
NetC705_2: C705.2 C706.2 L703.2 L704.1
NetC707_2: C707.2 C708.2 L704.2 LK704.3
NetC710_1: C710.1 R702.1
NetC710_2: C710.2 C711.2 R701.2 U701.5(VOUT)
NetC713_1: C713.1 R705.1
NetC713_2: C713.2 C714.2 R704.2 U702.5(VOUT)
NetL701_1: L701.1 LK701.4
NetL703_1: L703.1 LK703.4
NetLK701_2: LK701.2 LK702.1
NetLK703_2: LK703.2 LK704.1
NetR701_1: R701.1 R702.2 R703.2 U701.4(SENSE/ADJ)
NetR704_1: R704.1 R705.2 R706.2 U702.4(ADJ)

### Notes on the sheet
- Vout=5.0V*(1+R701/R703)
  Vout=18.0V
- Vout=-1.22V*(1+R704/R705)
  Vout=-18.0V

### Library data of the parts
L701-L704 = Inductor Iron: Magnetic-Core Inductor
R701-R706 = Res: 电阻
U701 = ADP7142AUJ: 40 V, 200 mA, Low Noise, CMOS LDO Linear Regulator
U702 = ADP7182AUJ: –28 V, −200 mA, Low Noise, Linear Regulator

## Nets that join several sheets
+18V: Low Distortion Oscillator.Osc (11 pins), Low Distortion Oscillator.Notch1 (C213.2 U201.8), Low Distortion Oscillator.Amp (12 pins), Low Distortion Oscillator.Amp3 (C501.2 U501.3)
-18V: Low Distortion Oscillator.Osc (11 pins), Low Distortion Oscillator.Notch1 (C214.1 U201.4), Low Distortion Oscillator.Amp (9 pins), Low Distortion Oscillator.Amp3 (C502.1 U501.6)
GND: Low Distortion Oscillator.Osc (24 pins), Low Distortion Oscillator.Con (19 pins), Low Distortion Oscillator.Notch1 (25 pins), Low Distortion Oscillator.Amp (19 pins), Low Distortion Oscillator.Amp2 (27 pins), Low Distortion Oscillator.Amp3 (C501.1 C502.2 P501.1 P502.3), Low Distortion Oscillator.DCDC (15 pins), Low Distortion Oscillator.LDO (16 pins)
AMP1_IN: Low Distortion Oscillator.Amp (P301.1 P305.2 R301.2), Low Distortion Oscillator.Amp2 (J411.1 P408.1)
AMP1_OUT: Low Distortion Oscillator.Amp (9 pins), Low Distortion Oscillator.Amp2 (J401.1 P401.1), Low Distortion Oscillator.Amp3 (P503.1)
AMP2_IN: Low Distortion Oscillator.Amp (P301.2 P301.4 R312.2 U302.3), Low Distortion Oscillator.Amp2 (J403.1 P403.1)
AMP2_OUT+: Low Distortion Oscillator.Amp (P312.1 U302.1 U302.2), Low Distortion Oscillator.Amp2 (J402.1 P402.1)
AMP2_OUT-: Low Distortion Oscillator.Amp (P313.1 R315.1 U302.7), Low Distortion Oscillator.Amp2 (J404.1 P402.3)
AMP3_IN+: Low Distortion Oscillator.Amp (P312.2 R302.2), Low Distortion Oscillator.Amp2 (J405.1 P404.1)
AMP3_IN-: Low Distortion Oscillator.Amp (P313.2 R311.2), Low Distortion Oscillator.Amp2 (J407.1 P404.3)
AMP3_OUT+: Low Distortion Oscillator.Amp (R304.1 U303.1), Low Distortion Oscillator.Amp2 (J406.1 P405.1)
AMP3_OUT-: Low Distortion Oscillator.Amp (R314.1 U303.7), Low Distortion Oscillator.Amp2 (J408.1 P405.3)
DC24V: Low Distortion Oscillator.Con (P101#2.3 P106.1), Low Distortion Oscillator.DCDC (P601.1)
DC+18V: Low Distortion Oscillator.Osc (F24.1), Low Distortion Oscillator.Con (J102.1 P101#2.9)
DC-18V: Low Distortion Oscillator.Osc (F25.1), Low Distortion Oscillator.Con (J102.3 P101#2.11)
DCDC_+19V5: Low Distortion Oscillator.DCDC (5 pins), Low Distortion Oscillator.LDO (LK701.1 LK701.3)
DCDC_-19V5: Low Distortion Oscillator.DCDC (8 pins), Low Distortion Oscillator.LDO (LK703.1 LK703.3)
DIFAMP1_IN+: Low Distortion Oscillator.Amp2 (J412.1 P409.1), Low Distortion Oscillator.Amp3 (P503.2 P503.4 R503.2)
DIFAMP1_IN-: Low Distortion Oscillator.Amp2 (J413.1 P409.3), Low Distortion Oscillator.Amp3 (P501.2 R501.2)
DIFAMP1_OUT+: Low Distortion Oscillator.Amp2 (J415.1 P411.1), Low Distortion Oscillator.Amp3 (R502.1 U501.4)
DIFAMP1_OUT-: Low Distortion Oscillator.Amp2 (J416.1 P411.3), Low Distortion Oscillator.Amp3 (R504.1 U501.5)
DIFAMP1_VOCM: Low Distortion Oscillator.Amp2 (J414.1 P410.1), Low Distortion Oscillator.Amp3 (P502.2 P502.4 U501.2)
OSC_OUT: Low Distortion Oscillator.Osc (11 pins), Low Distortion Oscillator.Notch1 (P214.1), Low Distortion Oscillator.Amp (P305.1), Low Distortion Oscillator.Amp3 (P503.3)
VBIAS: Low Distortion Oscillator.Amp (7 pins), Low Distortion Oscillator.Amp2 (J409.1 P406.1)
VBIAS_BUF: Low Distortion Oscillator.Amp (P304.1 U301.6 U301.7), Low Distortion Oscillator.Amp2 (J410.1 P407.1), Low Distortion Oscillator.Amp3 (P502.1)